# Altium schematic sheet Micro.SchDoc
size A4
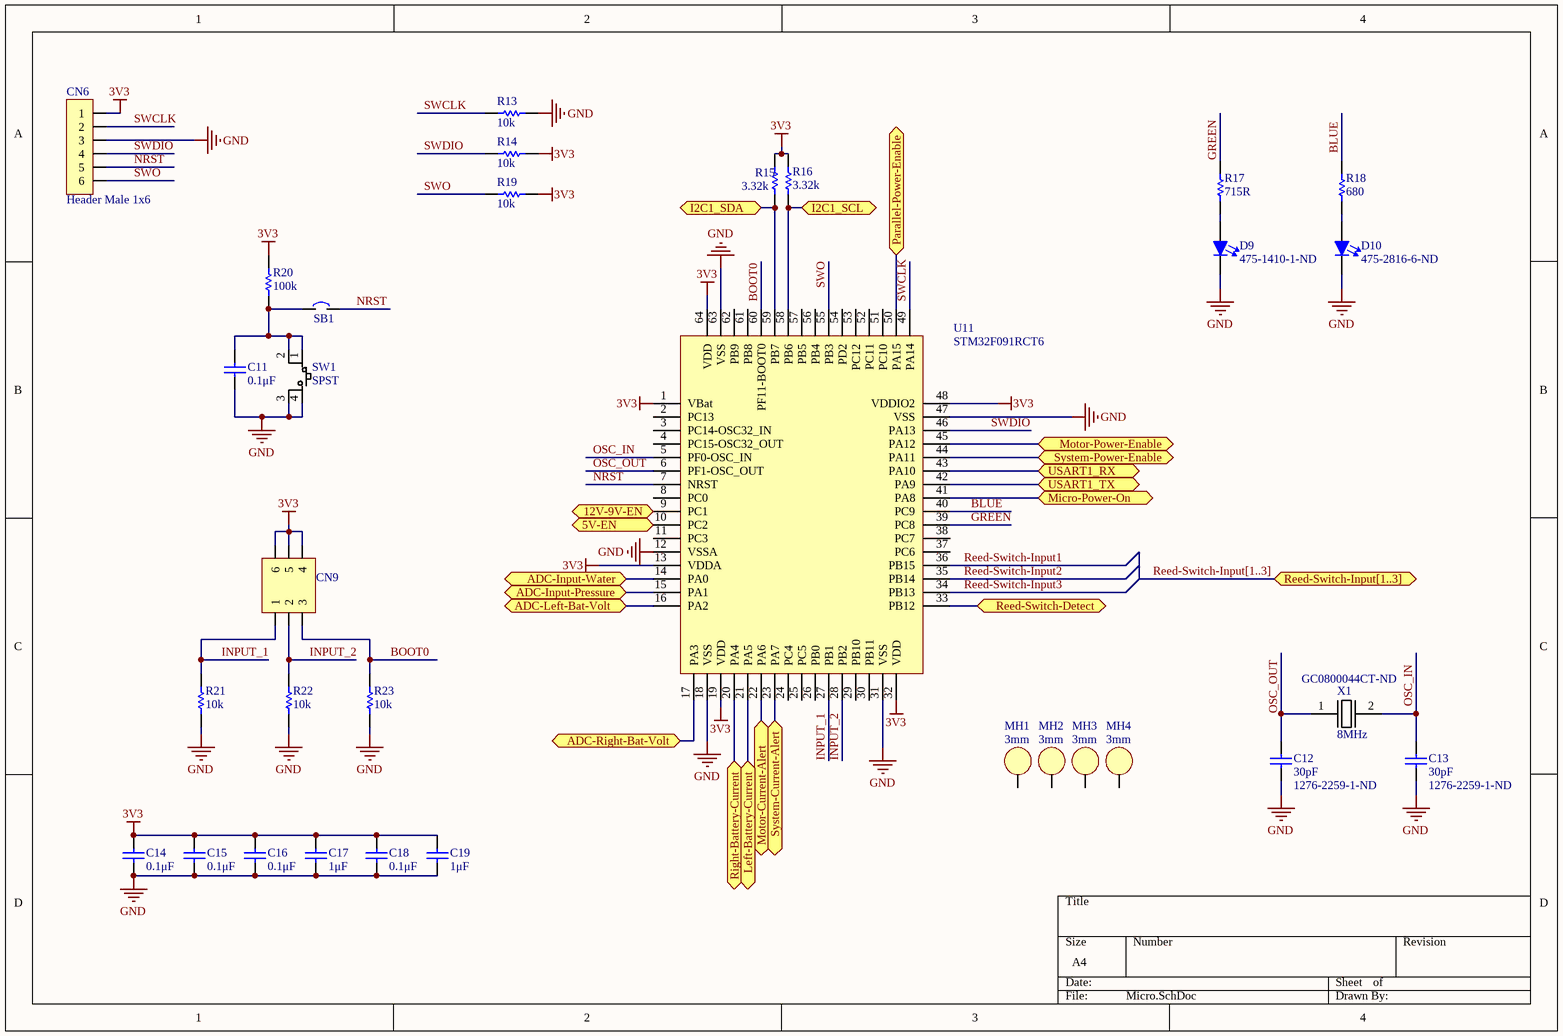
[diagram p0: Micro.SchDoc]

## Parts
C11  0.1μF  [CAPC1608N(0603")]
C12  30pF  Supplier Part Number 1: 1276-2259-1-ND  [CAPC1608N(0603")]
C13  30pF  Supplier Part Number 1: 1276-2259-1-ND  [CAPC1608N(0603")]
C14  0.1μF  [CAPC1608N(0603")]
C15  0.1μF  [CAPC1608N(0603")]
C16  0.1μF  [CAPC1608N(0603")]
C17  1μF  [CAPC1608N(0603")]
C18  0.1μF  [CAPC1608N(0603")]
C19  1μF  [CAPC1608N(0603")]
CN6  Header Male 1x6  [Header, Male, 1X6]
CN9  Header, Male, 2x3, Pitch: 0.1" (2.54mm), THT  [Header, Male, 2x3, Pitch: 0.1" (2.54mm),THT]  (value not drawn)
D9  Supplier Part Number 1: 475-1410-1-ND  [LED0805]  (hidden comment: Red)
D10  Supplier Part Number 1: 475-2816-6-ND  [LED0603]  (hidden comment: Blue)
MH1  3mm  [Mount-Hole_3mm]
MH2  3mm  [Mount-Hole_3mm]
MH3  3mm  [Mount-Hole_3mm]
MH4  3mm  [Mount-Hole_3mm]
R13  10k  [RESC1608N(0603")]
R14  10k  [RESC1608N(0603")]
R15  3.32k  [RESC1608N(0603")]
R16  3.32k  [RESC1608N(0603")]
R17  715R  [RESC1608N(0603")]
R18  680  [RESC2012N(0805")]
R19  10k  [RESC1608N(0603")]
R20  100k  [RESC1608N(0603")]
R21  10k  [RESC1608N(0603")]
R22  10k  [RESC1608N(0603")]
R23  10k  [RESC1608N(0603")]
SB1  Solder Bridge  [Solder Bridge]  (value not drawn)
SW1  SPST  [4-SPST-NO]
U11  STM32F091RCT6  [STM-LQFP64_N]
X1  8MHz  Supplier Part Number 1: GC0800044CT-ND  [HC49/US]

## Ports
5V-EN, 12V-9V-EN, ADC-Input-Pressure, ADC-Input-Water, ADC-Left-Bat-Volt, ADC-Right-Bat-Volt, I2C1_SCL, I2C1_SDA, Left-Battery-Current, Micro-Power-On, Motor-Current-Alert, Motor-Power-Enable, Parallel-Power-Enable, Reed-Switch-Detect, Reed-Switch-Input[1..3], Right-Battery-Current, System-Current-Alert, System-Power-Enable, USART1_RX, USART1_TX

## Nets
3V3: C14.2(Cathode) C15.2(Cathode) C16.2(Cathode) C17.2(Cathode) C18.2(Cathode) C19.2(Cathode) CN6.1 CN9.4 CN9.5 CN9.6 R14.2 R15.1 R16.1 R19.2 R20.2 U11.1(VBat) U11.13(VDDA) U11.19(VDD) U11.32(VDD) U11.48(VDDIO2) U11.64(VDD)
GND: C11.1(Anode) C12.1 C13.1 C14.1(Anode) C15.1(Anode) C16.1(Anode) C17.1(Anode) C18.1(Anode) C19.1(Anode) CN6.3 D9.1(Cathode) D10.1(Cathode) R13.1 R21.1 R22.1 R23.1 SW1.3 SW1.4 U11.12(VSSA) U11.18(VSS) U11.31(VSS) U11.47(VSS) U11.63(VSS)
5V-EN: U11.10(PC2) ; port 5V-EN
12V-9V-EN: U11.9(PC1) ; port 12V-9V-EN
ADC-Input-Pressure: U11.15(PA1) ; port ADC-Input-Pressure
ADC-Input-Water: U11.14(PA0) ; port ADC-Input-Water
ADC-Left-Bat-Volt: U11.16(PA2) ; port ADC-Left-Bat-Volt
ADC-Right-Bat-Volt: U11.17(PA3) ; port ADC-Right-Bat-Volt
BLUE: R18.2 U11.40(PC9)
BOOT0: CN9.3 R23.2 U11.60(PF11-BOOT0)
GREEN: R17.2 U11.39(PC8)
I2C1_SCL: R16.2 U11.58(PB6) ; port I2C1_SCL
I2C1_SDA: R15.2 U11.59(PB7) ; port I2C1_SDA
INPUT_1: CN9.1 R21.2 U11.27(PB1)
INPUT_2: CN9.2 R22.2 U11.28(PB2)
Left-Battery-Current: U11.21(PA5) ; port Left-Battery-Current
Micro-Power-On: U11.41(PA8) ; port Micro-Power-On
Motor-Current-Alert: U11.22(PA6) ; port Motor-Current-Alert
Motor-Power-Enable: U11.45(PA12) ; port Motor-Power-Enable
NRST: CN6.5 SB1.2 U11.7(NRST)
OSC_IN: C13.2 U11.5(PF0-OSC_IN) X1.2
OSC_OUT: C12.2 U11.6(PF1-OSC_OUT) X1.1
Parallel-Power-Enable: U11.50(PA15) ; port Parallel-Power-Enable
Reed-Switch-Detect: U11.33(PB12) ; port Reed-Switch-Detect
Reed-Switch-Input1: U11.36(PB15)
Reed-Switch-Input2: U11.35(PB14)
Reed-Switch-Input3: U11.34(PB13)
Right-Battery-Current: U11.20(PA4) ; port Right-Battery-Current
SWCLK: CN6.2 R13.2 U11.49(PA14)
SWDIO: CN6.4 R14.1 U11.46(PA13)
SWO: CN6.6 R19.1 U11.55(PB3)
System-Current-Alert: U11.23(PA7) ; port System-Current-Alert
System-Power-Enable: U11.44(PA11) ; port System-Power-Enable
USART1_RX: U11.43(PA10) ; port USART1_RX
USART1_TX: U11.42(PA9) ; port USART1_TX
NetC11_2: C11.2(Cathode) R20.1 SB1.1 SW1.1 SW1.2
NetD9_2: D9.2(Anode) R17.1
NetD10_2: D10.2(Anode) R18.1

Not connected (* = marked no-connect by the designer): MH1 1; MH2 1; MH3 1; MH4 1; U11 2(PC13) 3(PC14-OSC32_IN) 4(PC15-OSC32_OUT) 8(PC0) 11(PC3) 24(PC4) 25(PC5) 26(PB0) 29(PB10) 30(PB11) 37(PC6) 38(PC7) 51(PC10) 52(PC11) 53(PC12) 54(PD2) 56(PB4) 57(PB5) 61(PB8) 62(PB9)

## Buses and harness runs
bus Reed-Switch-Input[1..3] = port Reed-Switch-Input[1..3]

## Library data of the parts
C11 C14-C16 C18 = 0.1uF 100V 0603 SMD, Ceramic: Capacitor, Ceramic, 100V, +/- 10%, 0603 SMD, X7R; MFG: TDK; MFG#: CGA3E3X7S2A104K080AB; Published: 16-04-26; Publisher: AUVic; PackageDescription: Chip Capacitor; Value: 0.1μF; Created By: Ashwin Sira; Supplier 1: Digi-Key; Supplier Part Number 1: 445-6938-1-ND
C12 C13 = 30pF 50V 0603 SMD, Ceramic: Capacitor, Ceramic, 50V, +/-1%, 0603 SMD, C0G; Made By: Andy Bates; Published: 16-09-12; Publisher: AUVic; PackageDescription: Chip Capacitor; Value: 30pF; Supplier 1: Digi-Key
C17 C19 = 1uF 25V 0603 SMD, Ceramic: Capacitor, Ceramic, 25V, +/- 10%, 0603 SMD, X5R; MFG: Murata-Electronics-North-America; MFG#: GRM188R61E105KA12D; Published: 16-06-27; Publisher: AUVic; PackageDescription: Chip Capacitor; Value: 1μF; Created By: Andy Bates; Supplier 1: Digi-Key; Supplier Part Number 1: 490-3897-1-ND
CN6 = Header, Male, 1x6: 1x6, Pads Pitch: 0.1" (2.54mm), Through hole; Made Bates: Andy Bates; Supplier 1: Digikey; Supplier 1 Part Number: 952-2270-ND
D9 = LED, 0805 (2012), Green, Clear: Colour: Red; Created By: Andy Bates; Supplier 1: Digi-Key
D10 = LED, 0603 (1608), Blue, Clear: Colour: Blue; Created By: Lyden Smith; Date Created: 2017-09-19; Supplier 1: Digi-Key
MH1-MH4 = Mount_Hole_3mm
R13 R14 R19 R21-R23 = 10kR, 1%, 1/10W, 0603 SMD: Made By: Ashwin Sira; Owned By: AUVic; Created On: 14-05-31; Last Edited: 14-05-31; Supplier 1: Digi-Key; Supplier Part Number 1: 311-10.0KHRCT-ND; Value: 10k
R15 R16 = 3.32k, 1%, 1/10W, 0603, SMD: Created By: Ashwin Sira; Publisher: AUVic; Date Created: 2016-06-25; Value: 3.32k; Supplier 1: Digi-Key; Supplier Part Number 1: RMCF0603FT3K32CT-ND
R17 = 715R, 1%, 1/10W, 0603, SMD: Created By: Ashwin Sira; Publisher: AUVic; Date Created: 2016-06-10; Value: 715R; Supplier 1: Digi-Key; Supplier Part Number 1: 541-715HCT-ND
R18 = 680, 5%, 1/8W, 0805 SMD: Value: 680; Created By: Lyden Smith; Created On: 2017-06-04; Supplier 1: Digi-Key; Supplier Part Number 1: RMCF0805JT680RCT-ND
R20 = 100kR, 1%, 1/10W, 0603 SMD: Made By: Andy Bates; Owned By: AUVic; Created On: 14-06-30; Last Edited: 14-06-30; Value: 100k; Supplier 1: Digi-Key; Supplier Part Number 1: 311-100KGRCT-ND
SB1 = Solder Bridge: Made By: Andy Bates; Created On: 2016/09/08
SW1 = 4 pin Tacitle Switch: Made By: Andy Bates; Button Type: Single Pole Single Throw; Supplier 1: Digikey; Supplier 1 Part Number: CKN9084CT-ND
U11 = STM32F091RCT6: Made By: Andy Bates; Supplier 1: Digikey; Supplier 1 Part Number: 497-15167-ND
X1 = Oscillator 8MHz 40ESR: 8Mhz 40ESR  16pF -20°C ~ 70°C; Made By: Lyden Smith; Date Made: 2017-09-18; Supplier 1: Digi-Key
CN9 = Header, Male, 2x3, Pitch: 0.1" (2.54mm), THT: Publisher: AUVic; Date Published: 2017-09-13; Last Updated: *; Reviewed By: *; Created By: Andy Bates